# Altium schematic sheet Sheet2.SchDoc
size A4; SheetNumber: 1; SheetTotal: 2
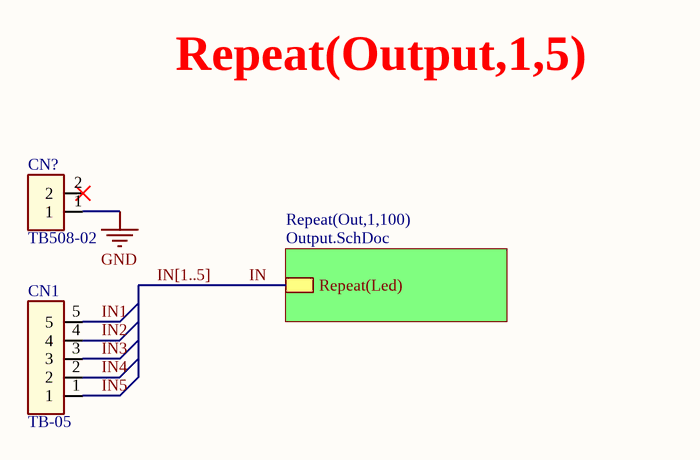
[diagram p0: Sheet2.SchDoc]

## Parts
CN1  TB-05  [TB508-05]
CN?  TB508-02  [TB508-02]

## Sub-sheets
Repeat(Out,1,100) = Output.SchDoc: Repeat(Led)

## Nets
GND: CN?.1
IN: sheet Repeat(Out,1,100)/Repeat(Led)
IN1: CN1.5
IN2: CN1.4
IN3: CN1.3
IN4: CN1.2
IN5: CN1.1

Not connected (* = marked no-connect by the designer): CN? 2*

## Buses and harness runs
bus IN[1..5]

## Notes on the sheet
- Repeat(Output,1,5)

## Library data of the parts
CN1 = TB-05: Terminal Block; Manufacturer: *; Part number: *; Unit price: *; Value: TB-05
CN? = TB-02: Terminal Block; Manufacturer: *; Part number: *; Unit price: *; Value: TB508-02